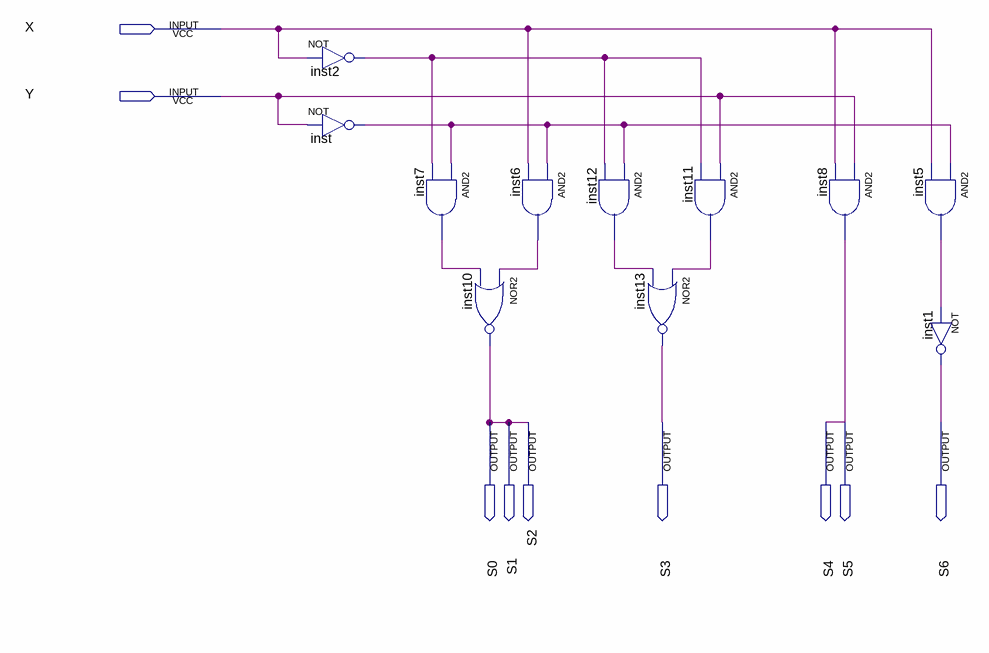
[diagram p0: schematic sheet]
// Quartus schematic circuito_base.bdf as structural Verilog: 11 symbols, 9 pins
module circuito_base (
  input  X,
  input  Y,
  output S0,
  output S1,
  output S2,
  output S3,
  output S4,
  output S5,
  output S6
);

  wire inst2_out, inst5_out, inst6_out, inst7_out, inst11_out, inst12_out, inst_out;

  not inst2 (inst2_out, X);
  not inst (inst_out, Y);
  and inst7 (inst7_out, inst_out, inst2_out);
  nor inst10 (S0, inst6_out, inst7_out);
  and inst6 (inst6_out, inst_out, X);
  and inst12 (inst12_out, inst_out, inst2_out);
  and inst11 (inst11_out, Y, inst2_out);
  nor inst13 (S3, inst11_out, inst12_out);
  and inst8 (S4, Y, X);
  and inst5 (inst5_out, inst_out, X);
  not inst1 (S6, inst5_out);

  assign S1 = S0;
  assign S2 = S0;
  assign S5 = S4;
endmodule
